# EAGLE design Me-Line Finder v2.0 (EAGLE 6.2)
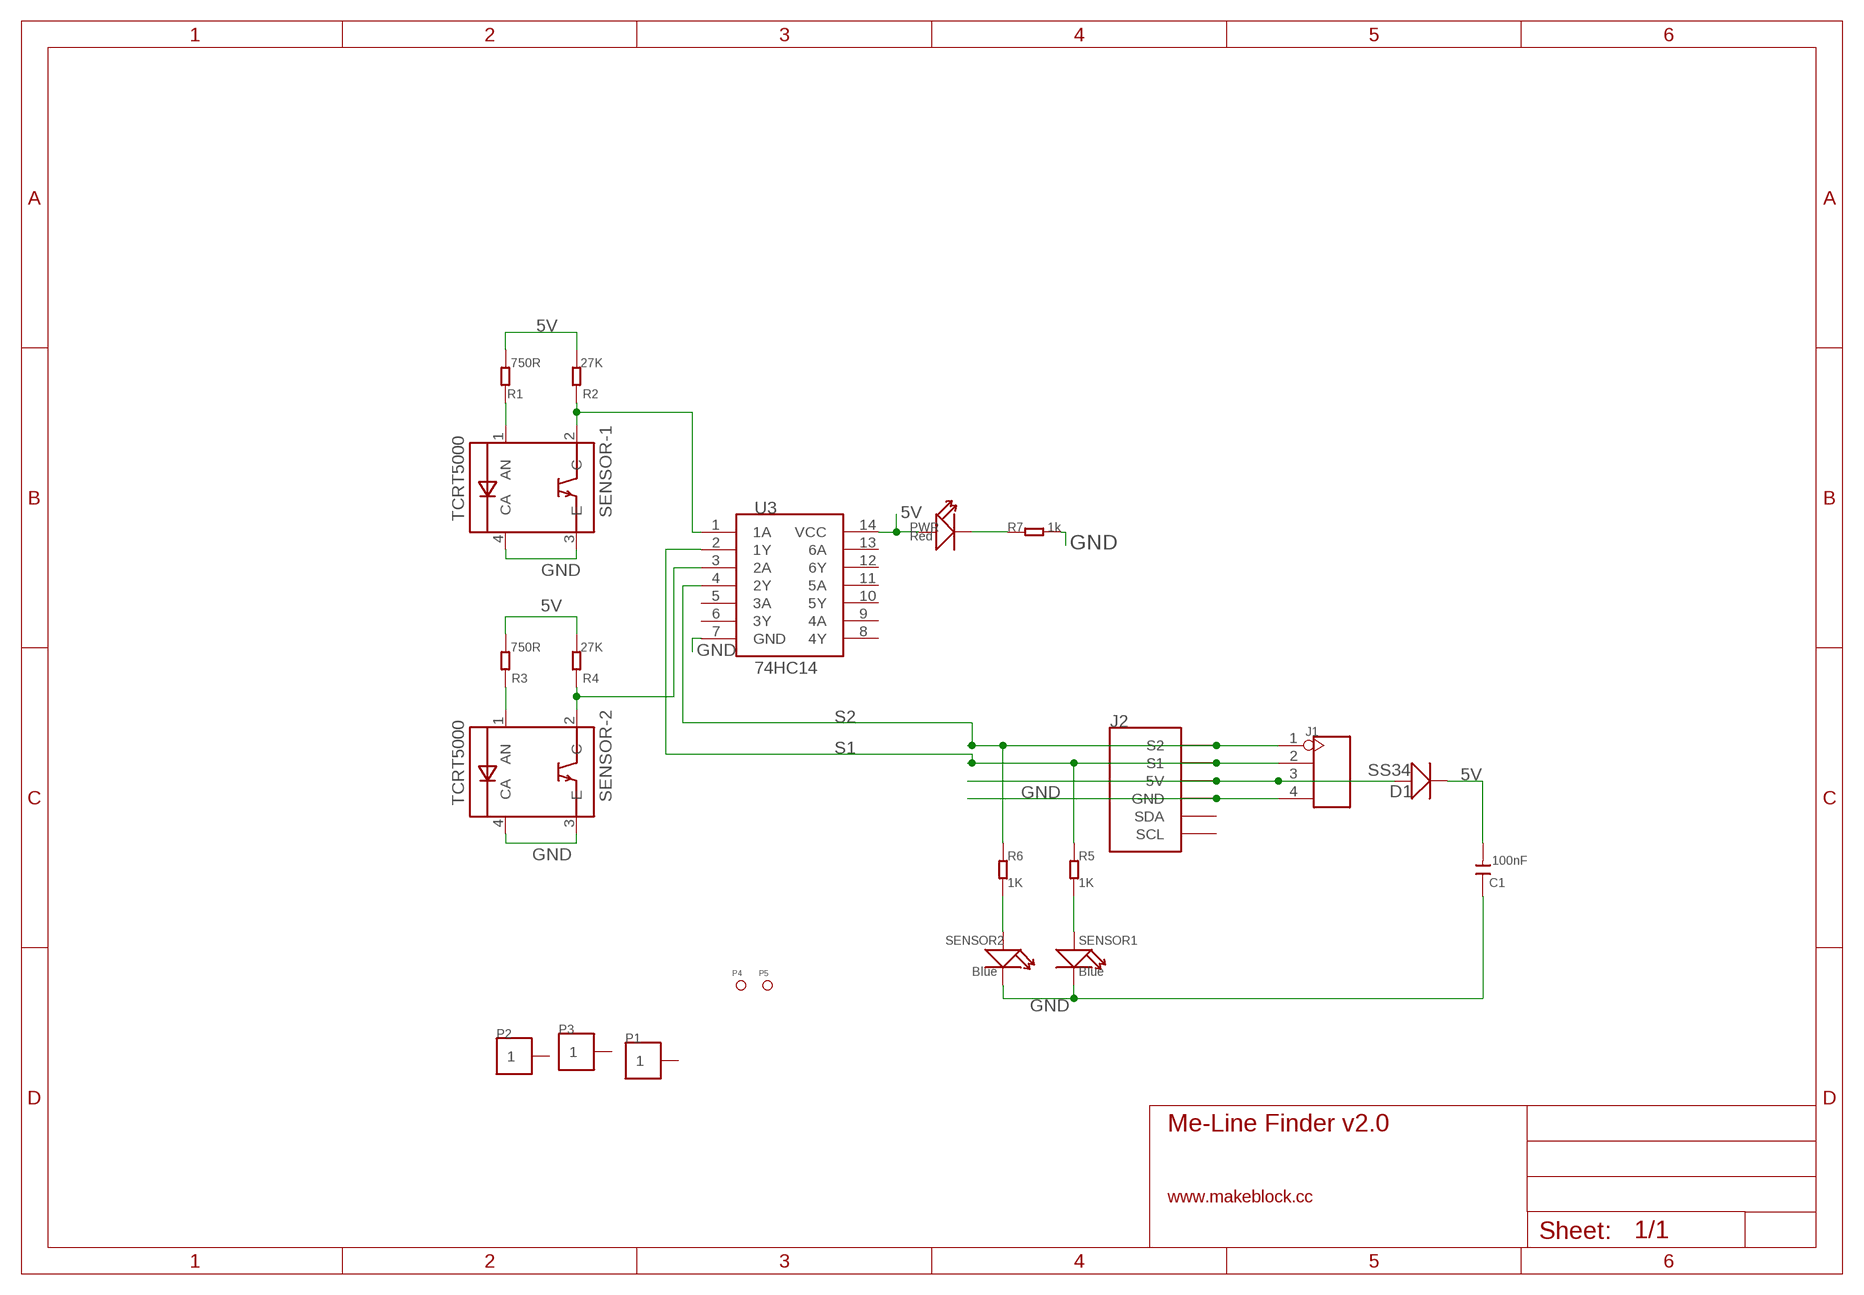
[diagram p0: schematic, sheet 1]

## Parts
C1  100nF  C-0603  [0603]
D1  SS34  D'SMA'  [D2010]
J1  HEADER-4P-60/35MIL  [4P-65/35MIL]
J2  RJ11-6P6C-DIGI  [RJ11-6P6C]
P1  PAD-1P-4MM  [HOLE-01]
P2  PAD-1P-4MM  [HOLE-01]
P3  PAD-1P-4MM  [HOLE-01]
P4  PAD-MARK  [ROUND-MARK-1.0]
P5  PAD-MARK  [ROUND-MARK-1.0]
PWR  Red  LED'0603'  [LED-0603]
R1  750R  R-0603  [0603]
R2  27K  R-0603  [0603]
R3  750R  R-0603  [0603]
R4  27K  R-0603  [0603]
R5  1K  R-0603  [0603]
R6  1K  R-0603  [0603]
R7  1k  R-0603  [0603]
SENSOR1  Blue  LED'0603'  [LED-0603]
SENSOR2  Blue  LED'0603'  [LED-0603]
SENSOR-1  TCRT5000  [TCRT5000]
SENSOR-2  TCRT5000  [TCRT5000]
U3  74HC14  [TSSOP14]

## Nets
5V: C1.2 D1.- PWR.+ R1.2 R2.2 R3.2 R4.2 U3.14(VCC)
GND: C1.1 J1.4 J2.3(GND) R7.2 SENSOR1.- SENSOR2.- SENSOR-1.3(E) SENSOR-1.4(CA) SENSOR-2.3(E) SENSOR-2.4(CA) U3.7(GND)
N$1: R5.2 SENSOR1.+
N$2: R6.2 SENSOR2.+
N$3: R2.1 SENSOR-1.2(C) U3.1(1A)
N$4: R1.1 SENSOR-1.1(AN)
N$5: R4.1 SENSOR-2.2(C) U3.3(2A)
N$6: R3.1 SENSOR-2.1(AN)
N$7: PWR.- R7.1
N$8: D1.+ J1.3 J2.4(5V)
S1: J1.2 J2.5(S1) R5.1 U3.2(1Y)
S2: J1.1 J2.6(S2) R6.1 U3.4(2Y)
Unconnected: J2.1(SCL) J2.2(SDA) P1.1 P2.1 P3.1 U3.5(3A) U3.6(3Y) U3.8(4Y) U3.9(4A) U3.10(5Y) U3.11(5A) U3.12(6Y) U3.13(6A)

## Notes on the sheet
- www.makeblock.cc

## Library data of the parts
C1 = Discrete:C*: Ceramic Capacitors
D1 = Discrete:D*
J1 = Connector:HEADER-4P
J2 = Makeblock:RJ11-6P6C-DIGI
P1-P3 = Makeblock:PAD-1P*
P4 P5 = Discrete:PAD-MARK; PARTNO: DNP
PWR SENSOR1 SENSOR2 = Discrete:LED*
R1-R7 = Discrete:R*
SENSOR-1 SENSOR-2 = Makeblock:TCRT5000
U3 = IC:74HC14

## Board
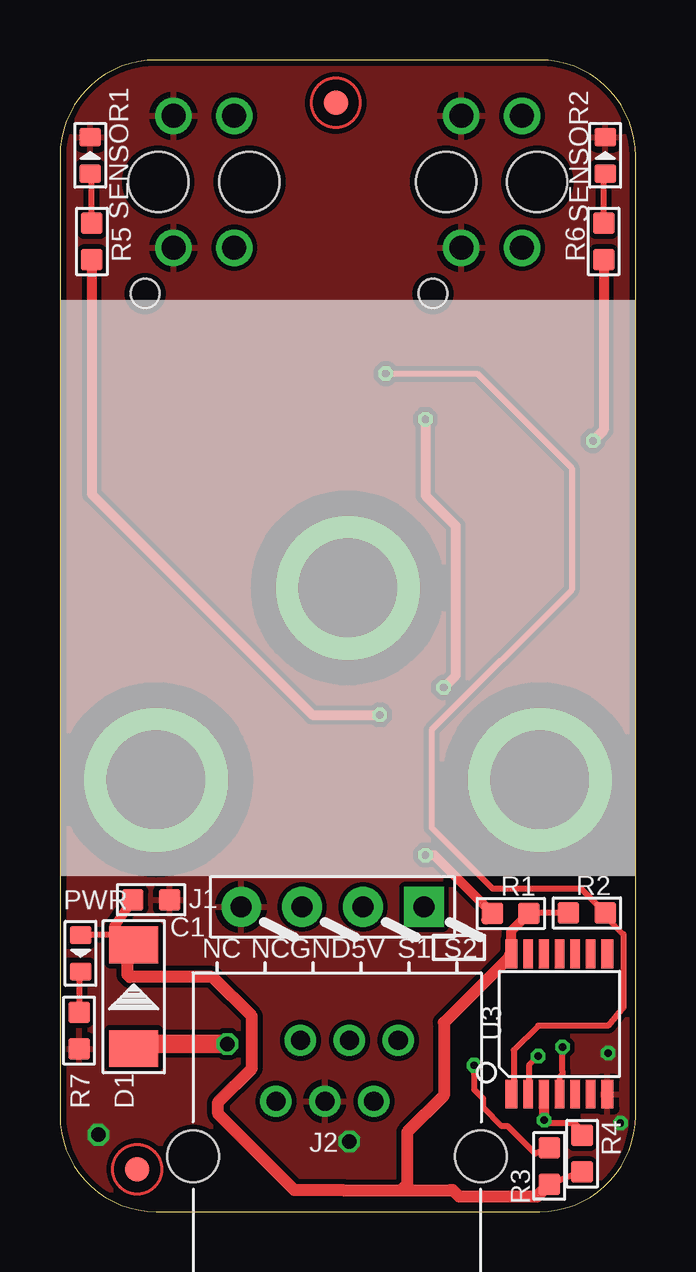
[diagram p1: board, top side]
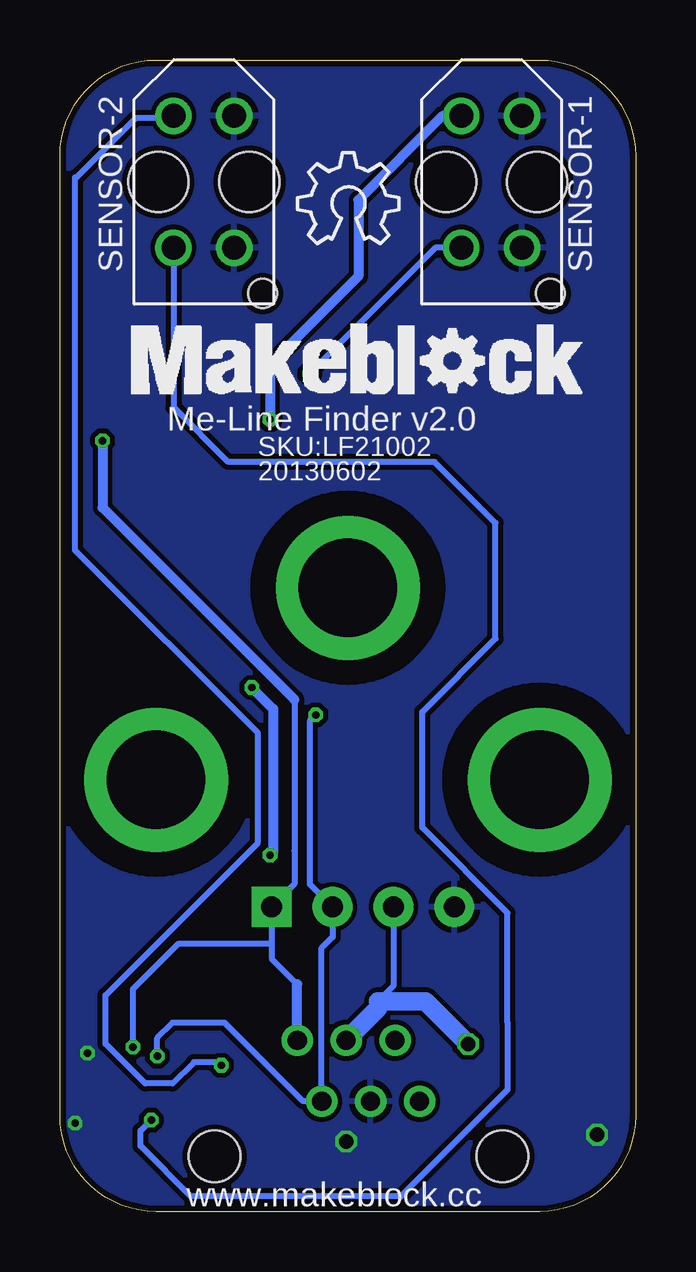
[diagram p2: board, bottom side, seen from below]

Size 24 x 48 mm. Coordinates in mm from the lower left corner, seen from the top.
Outline: 4,0 20,0 arc90 24,4 24,44 arc90 20,48 4,48 arc90 0,44 0,4 arc90 4,0
Copper layers (1*16): Top 0.035mm / dielectric 1.5mm / Bottom 0.035mm
Design rules: minimum track width 6mil, minimum drill 12mil, track to track 8mil, track to pad 8mil, pad to pad 8mil, via to via 8mil, smd to smd 0mil, copper to edge 10mil, drill to drill 10mil, minimum pad ring 10mil, minimum via ring 6mil, stop-mask expansion 2mil, vias tented up to drill 100mil, thermal gap 10mil

### Footprints (pad centres in the part's own frame; a part is rotated, then mirrored left to right if it is on the bottom)
0603 = smd 0.889 x 0.889: 1 -0.762,0; 2 0.762,0
D2010 = smd 1.524 x 2.032: + -2.159,0; - 2.159,0
4P-65/35MIL = drill 0.889 pad 1.651 square: 1 0,3.81 | drill 0.889 pad 1.651: 2 0,1.27; 3 0,-1.27; 4 0,-3.81
RJ11-6P6C = drill 0.8: 1 -2.55,1.8; 2 -1.53,4.34; 3 -0.51,1.8; 4 0.51,4.34; 5 1.53,1.8; 6 2.55,4.34 | hole 2.15: -6,-0.5; 6,-0.5
HOLE-01 = drill 4.1 pad 6: 1 0,0
ROUND-MARK-1.0 = smd 1.016 x 1.016: P$1 0,0
LED-0603 = smd 0.762 x 0.889: + -0.762,0; - 0.762,0
TCRT5000 = drill 1: 1 -1.27,2.75; 2 -1.27,-2.75; 3 1.27,-2.75; 4 1.27,2.75 | hole 2.5: -1.9,0; 1.9,0 | hole 1.2: 2.45,-4.65
TSSOP14 = smd 0.5 x 1.2: 1 -2,-2.925; 7 2,-2.925; 8 2,2.925; 14 -2,2.925 | smd 0.4 x 1.2: 2 -1.3,-2.925; 3 -0.65,-2.925; 4 0,-2.925; 5 0.65,-2.925; 6 1.3,-2.925; 9 1.3,2.925; 10 0.65,2.925; 11 0,2.925; 12 -0.65,2.925; 13 -1.3,2.925

### Placement (x,y rotation side)
C1  3.8,12.99 180 top
D1  3.08,8.96 90 top
J1  11.37,12.7 270 top
J2  11.56,2.79 0 top
P1  12,26 0 bottom
P2  20,18 0 bottom
P3  4,18 0 bottom
P4  11.5,46.22 180 top
P5  3.22,1.77 180 top
PWR  0.86,10.76 270 top
R1  18.8,12.42 0 top
R2  21.97,12.44 180 top
R3  20.4,1.9 270 top
R4  21.77,2.41 270 top
R5  1.33,40.43 90 top
R6  22.67,40.43 90 top
R7  0.8,7.54 270 top
SENSOR1  1.26,44.02 90 top
SENSOR2  22.74,44.02 90 top
SENSOR-1  6,42.92 0 bottom
SENSOR-2  18,42.92 0 bottom
U3  20.83,7.82 0 top
U$1  [LOGO-3/2]  21.03,34.07 0 bottom
U$2  [OSHW_6X150_NOTEXT]  14.1,40.33 0 bottom

### Tracks (layer width: path | path; a pad name or v marks a point on that pad's centre or on a via)
5V
  Top 0.254: R2.2 19.58,12.44 R1.2 19.56,12.45 | R4.2 R3.2 | 2.63,11.52 PWR.+
  Top 0.406: R1.2 18.83,11.69 U3.14 18.75,10.67 | 2.63,11.52 3.08,11.52 D1.- 2.28,11.91 C1.2
  Top 0.508: 14.22,0.89 11.81,0.89 9.78,0.89 6.6,4.06 6.6,4.57 8,5.97 8,8.13 6.35,9.78 2.92,9.78 2.82,9.88 2.82,10.86 D1.- 3.42,11.46 | 14.22,0.89 16.26,0.89 16.38,0.89 16.64,0.64 19.89,0.64 R3.2 | 18.75,10.67 18.75,10.62 16,7.87 16,4.83 14.48,3.3 14.48,1.14 14.22,0.89
GND  (via drill 0.3 pad 0.61, 0.6)
  other vias: 22.86,6.6 1.6,3.2 12.06,2.92 23.37,3.68
  pour Bottom: 24,0 24,47.88 0,47.88 0,0
  pour Top: 24,0 24,47.88 0,47.88 0,0
N$1
  Top 0.254: R5.2 1.33,43.19 SENSOR1.+
N$2
  Top 0.254: R6.2 22.67,43.19 SENSOR2.+
N$3  (via drill 0.3 pad 0.61)
  Top 0.254: U3.1 18.92,4.93 18.92,6.73 19.94,7.75 22.86,7.75 23.5,8.51 23.5,11.56 22.73,12.32 R2.1 21.71,13.46 18.03,13.46 15.49,16 15.49,20.07 21.34,25.91 21.34,30.99 17.4,34.92 v13.59,34.92
  Bottom 0.254: SENSOR-1.2 8.34,40.17 v13.59,34.92
N$4  (via drill 0.3 pad 0.61)
  Top 0.406: 17.78,12.17 R1.1 15.6,14.86 v15.24,14.86 | v15.24,33.02 15.24,29.84 16.51,28.57 16.51,22.35 v16,21.84
  Bottom 0.406: SENSOR-1.1 8.05,45.67 11.56,42.16 11.56,38.99 15.24,35.31 v15.24,33.02 | v16,21.84 15.11,20.95 15.11,14.99 v15.24,14.86
N$5  (via drill 0.3 pad 0.61)
  Top 0.254: R4.1 21.9,3.25 21.46,3.68 20.32,3.68 v20.19,3.81
  Top 0.406: U3.3 20.18,3.94 v20.19,3.81
  Bottom 0.254: SENSOR-2.2 19.27,33.53 16.98,31.24 8.38,31.24 5.84,28.7 5.84,23.88 8.89,20.83 8.89,16 5.33,12.45 5.33,7.87 5.33,5.08 9.78,0.64 18.54,0.64 20.64,2.73 20.64,3.11 20.64,3.37 v20.19,3.81
N$6  (via drill 0.3 pad 0.61)
  Top 0.254: v17.27,6.1 17.27,5.08 17.65,4.7 17.65,4.32 18.41,3.56 18.67,3.56 19.81,2.41 R3.1
  Bottom 0.254: v17.27,6.1 17.4,6.22 18.41,6.22 19.3,5.33 20.45,5.33 22.1,6.99 22.1,9.02 15.75,15.37 15.75,19.94 23.37,27.56 23.37,43.1 23.32,43.1 20.83,45.59 19.35,45.59 SENSOR-2.1
N$7
  Top 0.254: PWR.- 0.8,9.93 R7.1
N$8  (via drill 0.6)
  Top 0.762: 2.92,6.64 D1.+ 3.27,6.99 v6.99,6.99
  Bottom 0.254: J1.3 10.1,9.4 10.73,8.76
  Bottom 0.508: 10.73,8.76 10.73,8.47
  Bottom 0.762: 10.73,8.47 J2.4 | v6.99,6.99 6.96,6.96 v6.99,6.99 | v6.99,6.99 8.76,8.76 10.73,8.76
S1  (via drill 0.3 pad 0.61)
  Top 0.254: v19.94,6.48 19.56,6.1 19.56,4.92 U3.2
  Top 0.406: R5.1 1.33,29.91 10.54,20.7 v13.34,20.7
  Bottom 0.254: v19.94,6.48 19.94,7.24 19.3,7.87 17.14,7.87 16.26,6.99 13.87,4.59 J2.5 13.09,10.99 12.63,11.44 J1.2 13.59,13.65 13.59,15.05 13.59,20.45 v13.34,20.7
S2  (via drill 0.3 pad 0.61)
  Top 0.254: v20.95,6.86 20.96,5.84 20.96,5.72 20.83,5.59 U3.4
  Top 0.406: R6.1 22.67,32.57 v22.23,32.13
  Bottom 0.254: v20.95,6.86 20.95,9.27 19.05,11.18 15.81,11.18 15.18,11.18 | 14.22,21.34 14.22,15.04 14.22,13.65 J1.1 15.18,11.18 | 15.18,11.18 15.18,10.54 14.11,9.47
  Bottom 0.406: v22.23,32.13 22.23,29.34 14.22,21.34 | J2.6 14.11,9.47

### Text on the board
tPlace: SENSOR1 | SENSOR2 | NC | NC | GND | 5V | S1 | S2
bPlace: Me-Line Finder v2.0 | SKU:LF21002 | 20130602 | www.makeblock.cc